# EAGLE design PJ23 (EAGLE 7.4.0)

## Sheet 1 of 8: ws2812 martix
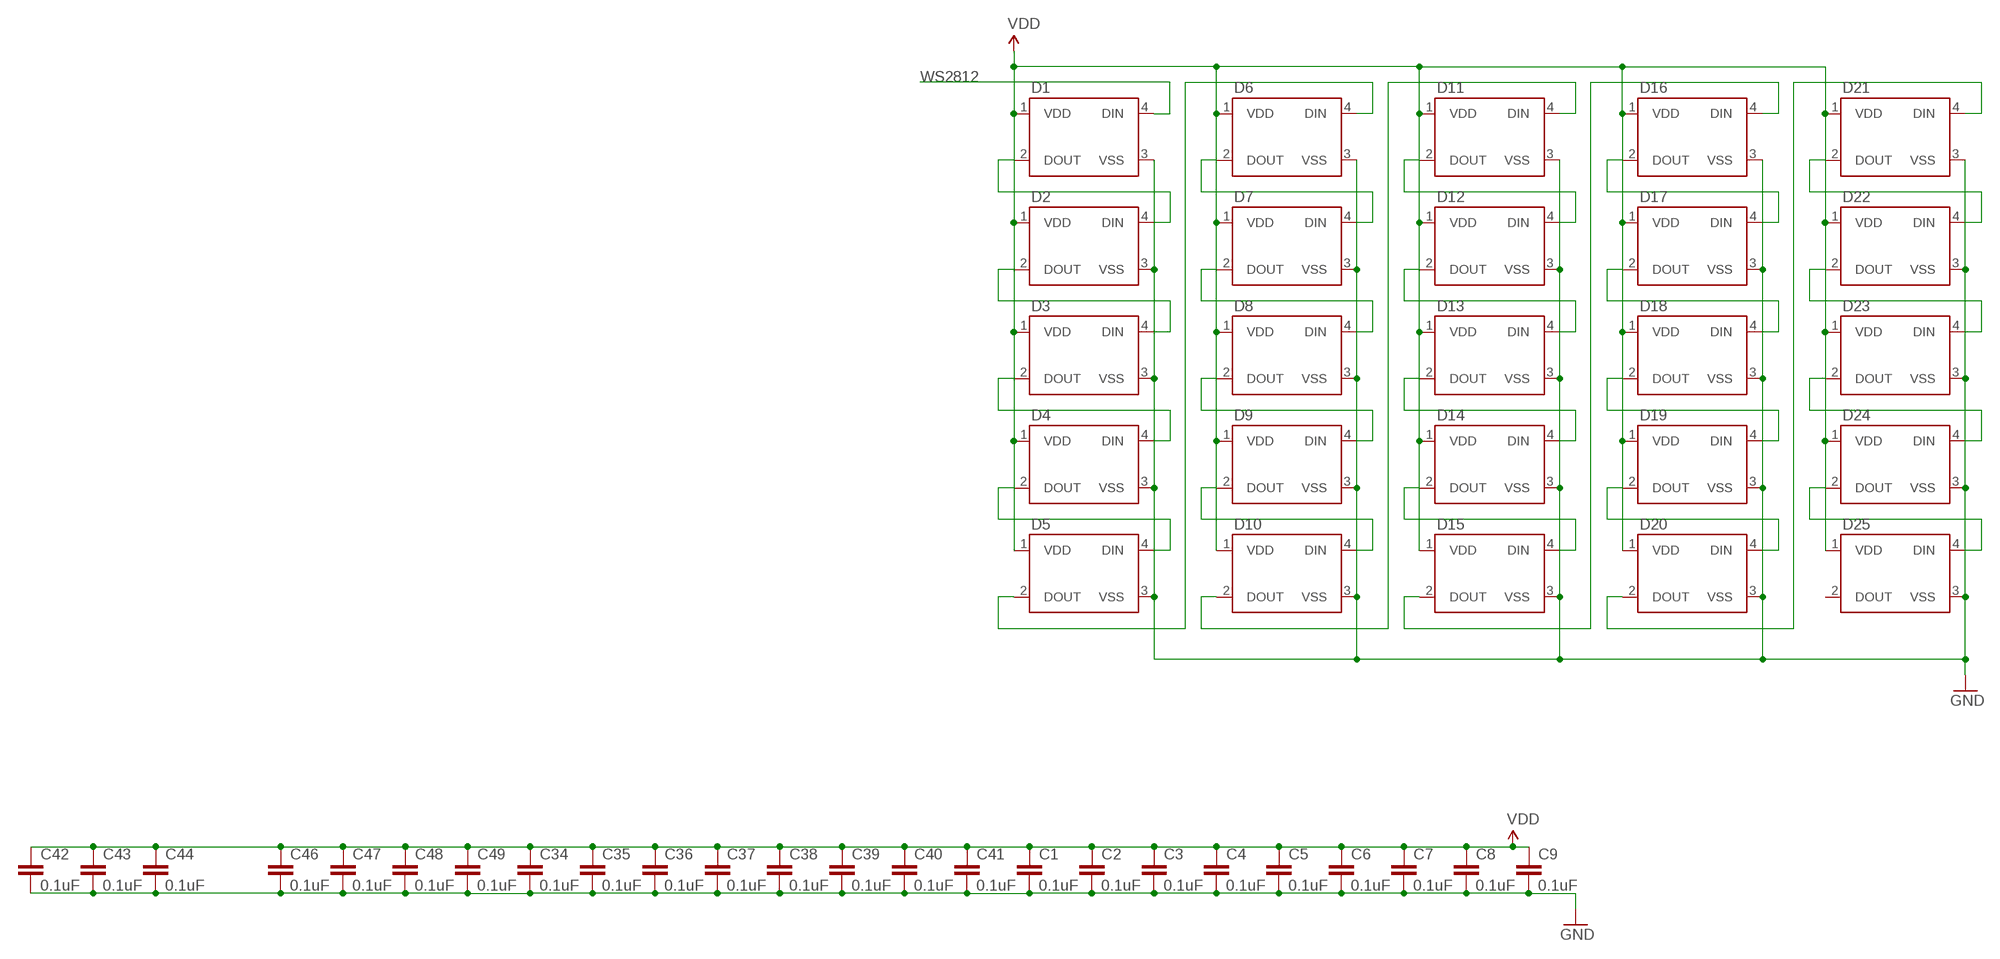
[diagram p0: schematic, sheet 1]

### Parts
C1  0.1uF  0.1UF-25V-5%(0603)  [0603-CAP]
C2  0.1uF  0.1UF-25V-5%(0603)  [0603-CAP]
C3  0.1uF  0.1UF-25V-5%(0603)  [0603-CAP]
C4  0.1uF  0.1UF-25V-5%(0603)  [0603-CAP]
C5  0.1uF  0.1UF-25V-5%(0603)  [0603-CAP]
C6  0.1uF  0.1UF-25V-5%(0603)  [0603-CAP]
C7  0.1uF  0.1UF-25V-5%(0603)  [0603-CAP]
C8  0.1uF  0.1UF-25V-5%(0603)  [0603-CAP]
C9  0.1uF  0.1UF-25V-5%(0603)  [0603-CAP]
C34  0.1uF  0.1UF-25V-5%(0603)  [0603-CAP]
C35  0.1uF  0.1UF-25V-5%(0603)  [0603-CAP]
C36  0.1uF  0.1UF-25V-5%(0603)  [0603-CAP]
C37  0.1uF  0.1UF-25V-5%(0603)  [0603-CAP]
C38  0.1uF  0.1UF-25V-5%(0603)  [0603-CAP]
C39  0.1uF  0.1UF-25V-5%(0603)  [0603-CAP]
C40  0.1uF  0.1UF-25V-5%(0603)  [0603-CAP]
C41  0.1uF  0.1UF-25V-5%(0603)  [0603-CAP]
C42  0.1uF  0.1UF-25V-5%(0603)  [0603-CAP]
C43  0.1uF  0.1UF-25V-5%(0603)  [0603-CAP]
C44  0.1uF  0.1UF-25V-5%(0603)  [0603-CAP]
C46  0.1uF  0.1UF-25V-5%(0603)  [0603-CAP]
C47  0.1uF  0.1UF-25V-5%(0603)  [0603-CAP]
C48  0.1uF  0.1UF-25V-5%(0603)  [0603-CAP]
C49  0.1uF  0.1UF-25V-5%(0603)  [0603-CAP]
D1  WS2812B  [WS2812B]
D2  WS2812B  [WS2812B]
D3  WS2812B  [WS2812B]
D4  WS2812B  [WS2812B]
D5  WS2812B  [WS2812B]
D6  WS2812B  [WS2812B]
D7  WS2812B  [WS2812B]
D8  WS2812B  [WS2812B]
D9  WS2812B  [WS2812B]
D10  WS2812B  [WS2812B]
D11  WS2812B  [WS2812B]
D12  WS2812B  [WS2812B]
D13  WS2812B  [WS2812B]
D14  WS2812B  [WS2812B]
D15  WS2812B  [WS2812B]
D16  WS2812B  [WS2812B]
D17  WS2812B  [WS2812B]
D18  WS2812B  [WS2812B]
D19  WS2812B  [WS2812B]
D20  WS2812B  [WS2812B]
D21  WS2812B  [WS2812B]
D22  WS2812B  [WS2812B]
D23  WS2812B  [WS2812B]
D24  WS2812B  [WS2812B]
D25  WS2812B  [WS2812B]

### Nets
GND: C1.2 C2.2 C3.2 C4.2 C5.2 C6.2 C7.2 C8.2 C9.2 C34.2 C35.2 C36.2 C37.2 C38.2 C39.2 C40.2 C41.2 C42.2 C43.2 C44.2 C46.2 C47.2 C48.2 C49.2 D1.3(VSS) D2.3(VSS) D3.3(VSS) D4.3(VSS) D5.3(VSS) D6.3(VSS) D7.3(VSS) D8.3(VSS) D9.3(VSS) D10.3(VSS) D11.3(VSS) D12.3(VSS) D13.3(VSS) D14.3(VSS) D15.3(VSS) D16.3(VSS) D17.3(VSS) D18.3(VSS) D19.3(VSS) D20.3(VSS) D21.3(VSS) D22.3(VSS) D23.3(VSS) D24.3(VSS) D25.3(VSS) ; also sheet 2,3,4,5,6,7,8
N$1: D1.2(DOUT) D2.4(DIN)
N$2: D2.2(DOUT) D3.4(DIN)
N$3: D3.2(DOUT) D4.4(DIN)
N$4: D4.2(DOUT) D5.4(DIN)
N$6: D5.2(DOUT) D6.4(DIN)
N$7: D6.2(DOUT) D7.4(DIN)
N$8: D7.2(DOUT) D8.4(DIN)
N$31: D8.2(DOUT) D9.4(DIN)
N$32: D9.2(DOUT) D10.4(DIN)
N$33: D10.2(DOUT) D11.4(DIN)
N$34: D11.2(DOUT) D12.4(DIN)
N$35: D12.2(DOUT) D13.4(DIN)
N$36: D13.2(DOUT) D14.4(DIN)
N$37: D14.2(DOUT) D15.4(DIN)
N$38: D15.2(DOUT) D16.4(DIN)
N$39: D16.2(DOUT) D17.4(DIN)
N$40: D17.2(DOUT) D18.4(DIN)
N$41: D18.2(DOUT) D19.4(DIN)
N$42: D19.2(DOUT) D20.4(DIN)
N$43: D20.2(DOUT) D21.4(DIN)
N$44: D21.2(DOUT) D22.4(DIN)
N$45: D22.2(DOUT) D23.4(DIN)
N$46: D23.2(DOUT) D24.4(DIN)
N$47: D24.2(DOUT) D25.4(DIN)
VDD: C1.1 C2.1 C3.1 C4.1 C5.1 C6.1 C7.1 C8.1 C9.1 C34.1 C35.1 C36.1 C37.1 C38.1 C39.1 C40.1 C41.1 C42.1 C43.1 C44.1 C46.1 C47.1 C48.1 C49.1 D1.1(VDD) D2.1(VDD) D3.1(VDD) D4.1(VDD) D5.1(VDD) D6.1(VDD) D7.1(VDD) D8.1(VDD) D9.1(VDD) D10.1(VDD) D11.1(VDD) D12.1(VDD) D13.1(VDD) D14.1(VDD) D15.1(VDD) D16.1(VDD) D17.1(VDD) D18.1(VDD) D19.1(VDD) D20.1(VDD) D21.1(VDD) D22.1(VDD) D23.1(VDD) D24.1(VDD) D25.1(VDD) ; also sheet 5,6
WS2812: D1.4(DIN) ; also sheet 4
Unconnected: D25.2(DOUT)

## Sheet 2 of 8: I2C bus devices
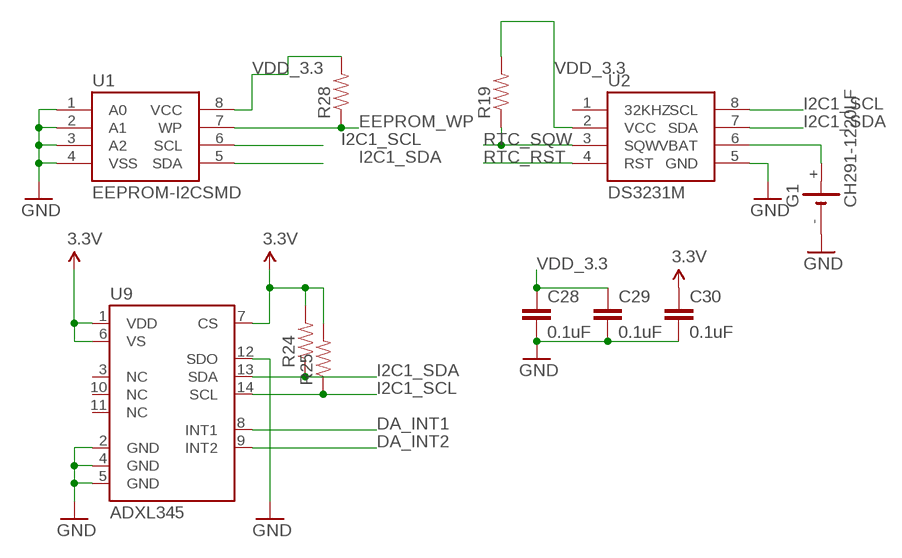
[diagram p1: schematic, sheet 2]

### Parts
C28  0.1uF  0.1UF-25V-5%(0603)  [0603-CAP]
C29  0.1uF  0.1UF-25V-5%(0603)  [0603-CAP]
C30  0.1uF  0.1UF-25V-5%(0603)  [0603-CAP]
G1  CH291-1220LF  [CH291-1220LF]
R19  RESISTOR0603  [0603-RES]
R24  RESISTOR0603  [0603-RES]
R25  RESISTOR0603  [0603-RES]
R28  RESISTOR0603  [0603-RES]
U1  EEPROM-I2CSMD  [SO08]
U2  DS3231M  [SOIC8]
U9  ADXL345  [LGA14]

### Nets
3.3V: C30.1 R24.2 R25.2 U9.1(VDD) U9.6(VS) U9.7(CS) ; also sheet 4,5,6
DA_INT1: U9.8(INT1) ; also sheet 4
DA_INT2: U9.9(INT2) ; also sheet 4
EEPROM_WP: R28.1 U1.7(WP) ; also sheet 4
GND: C28.2 C29.2 C30.2 G1.- U1.1(A0) U1.2(A1) U1.3(A2) U1.4(VSS) U2.5(GND) U9.2(GND) U9.4(GND) U9.5(GND) U9.12(SDO) ; also sheet 1,3,4,5,6,7,8
I2C1_SCL: R25.1 U1.6(SCL) U2.8(SCL) U9.14(SCL) ; also sheet 4
I2C1_SDA: R24.1 U1.5(SDA) U2.7(SDA) U9.13(SDA) ; also sheet 4
N$27: G1.+ U2.6(VBAT)
RTC_RST: U2.4(RST)
RTC_SQW: R19.1 U2.3(SQW)
VDD_3.3: C28.1 C29.1 R19.2 R28.2 U1.8(VCC) U2.2(VCC) ; also sheet 5
Unconnected: U2.1(32KHZ) U9.3(NC) U9.10(NC) U9.11(NC)

## Sheet 3 of 8: battery charger
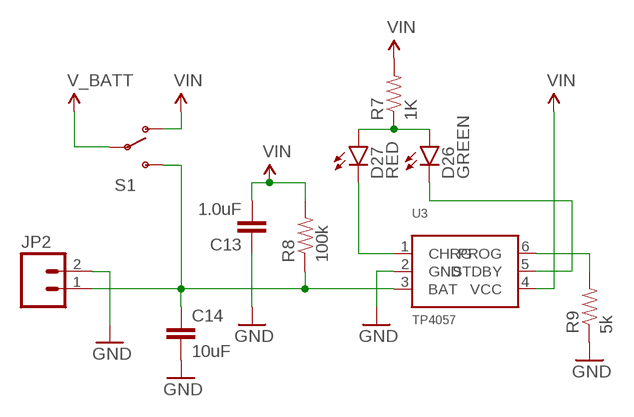
[diagram p2: schematic, sheet 3]

### Parts
C13  1.0uF  1.0UF-25V-+80/-20(0805)"  [0805-CAP]
C14  10uF  10UF-6.3V-20%(1206)  [1206]
D26  GREEN  LED-GREEN0603  [LED-0603]
D27  RED  LED-RED0603  [LED-0603]
JP2  M02LOCK  [1X02_LOCK]
R7  1K  1KOHM-1/10W-1%(0603)  [0603-RES]
R8  100k  100KOHM-1/10W-1%(0603)  [0603-RES]
R9  5k  RESISTOR0805-RES  [0805]
S1  SWITCH-SPDT-SMD-A  [SWITCH-SPST-SMD-A]
U3  TP4057  [SOT23-6]

### Nets
GND: C13.1 C14.2 JP2.2 R9.1 U3.2(GND) ; also sheet 1,2,4,5,6,7,8
N$12: D27.C U3.1(CHRG)
N$13: D26.C U3.5(STDBY)
N$16: D26.A D27.A R7.1
N$18: C14.1 JP2.1 R8.1 S1.3(S) U3.3(BAT)
N$19: R9.2 U3.6(PROG)
V_BATT: S1.2(P) ; also sheet 4,5,6
VIN: C13.2 R7.2 R8.2 S1.1(O) U3.4(VCC) ; also sheet 7,8

## Sheet 4 of 8: microcontroller
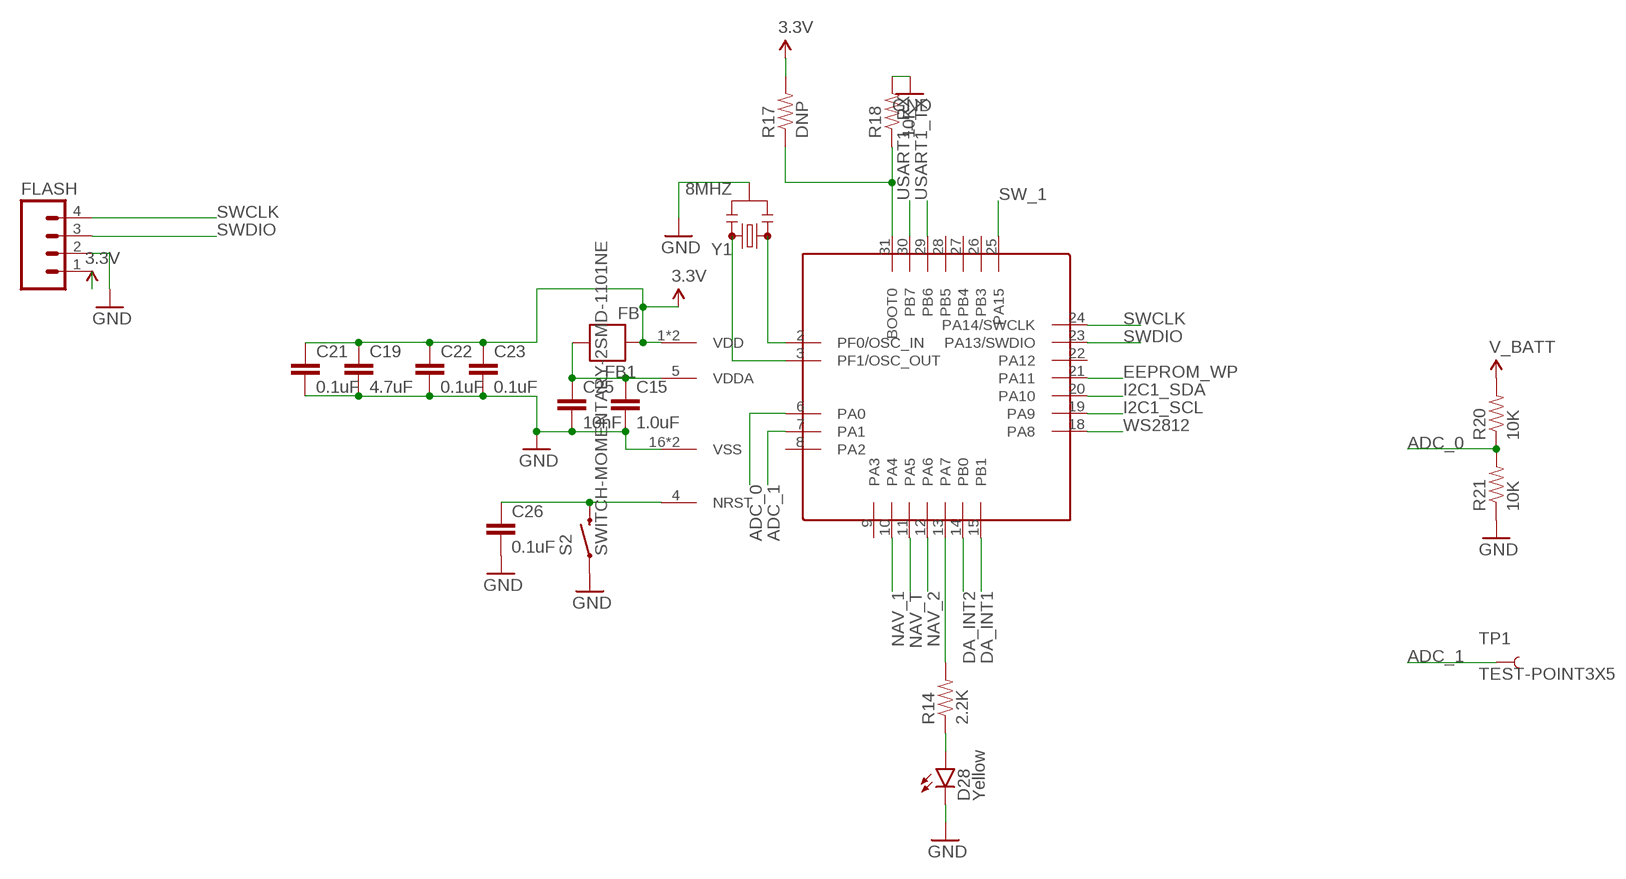
[diagram p3: schematic, sheet 4]

### Parts
C15  1.0uF  1.0UF-16V-10%(0603)  [0603-CAP]
C19  4.7uF  4.7UF-6.3V-10%(0603)0603  [0603-CAP]
C21  0.1uF  CAP0402-CAP  [0402-CAP]
C22  0.1uF  CAP0402-CAP  [0402-CAP]
C23  0.1uF  CAP0402-CAP  [0402-CAP]
C25  10nF  CAP0402-CAP  [0402-CAP]
C26  0.1uF  CAP0402-CAP  [0402-CAP]
D28  Yellow  LED-YELLOW0603  [LED-0603]
FB1  FB  [0603]
FLASH  M04SMD  [1X04-SMD]
R14  2.2K  RESISTOR0402  [0402-RES]
R17  DNP  22OHM1/10W1%(0402)  [0402-RES]
R18  10K  22OHM1/10W1%(0402)  [0402-RES]
R20  10K  22OHM1/10W1%(0402)  [0402-RES]
R21  10K  22OHM1/10W1%(0402)  [0402-RES]
S2  SWITCH-MOMENTARY-2SMD-1101NE  [TACTILE-SWITCH-1101NE]
TP1  TEST-POINT3X5  [PAD.03X.05]
U7  STM32F030K6P6  [LQFP32-0.8]
Y1  8MHZ  RESONATOR8MHZ  [RESONATOR-SMD]

### Nets
3.3V: C19.1 C21.1 C22.1 C23.1 FB1.2 FLASH.1 R17.2 U7.1(VDD) U7.17(VDD) ; also sheet 2,5,6
ADC_0: R20.1 R21.2 U7.6(PA0)
ADC_1: TP1.P$1 U7.7(PA1)
DA_INT1: U7.15(PB1) ; also sheet 2
DA_INT2: U7.14(PB0) ; also sheet 2
EEPROM_WP: U7.21(PA11) ; also sheet 2
GND: C15.2 C19.2 C21.2 C22.2 C23.2 C25.2 C26.2 D28.C FLASH.2 R18.2 R21.1 S2.1 U7.16(VSS) U7.32(VSS) Y1.2 ; also sheet 1,2,3,5,6,7,8
I2C1_SCL: U7.19(PA9) ; also sheet 2
I2C1_SDA: U7.20(PA10) ; also sheet 2
N$5: C15.1 C25.1 FB1.1 U7.5(VDDA)
N$23: R17.1 R18.1 U7.31(BOOT0)
N$24: D28.A R14.1
N$29: C26.1 S2.2 U7.4(NRST)
N$48: R14.2 U7.13(PA7)
NAV_1: U7.10(PA4) ; also sheet 6
NAV_2: U7.12(PA6) ; also sheet 6
NAV_T: U7.11(PA5) ; also sheet 6
PF0: U7.2(PF0/OSC_IN) Y1.1
PF1: U7.3(PF1/OSC_OUT) Y1.3
SW_1: U7.25(PA15) ; also sheet 6
SWCLK: FLASH.4 U7.24(PA14/SWCLK)
SWDIO: FLASH.3 U7.23(PA13/SWDIO)
USART1_RX: U7.30(PB7) ; also sheet 7
USART1_TX: U7.29(PB6) ; also sheet 7
V_BATT: R20.2 ; also sheet 3,5,6
WS2812: U7.18(PA8) ; also sheet 1
Unconnected: U7.8(PA2) U7.9(PA3) U7.22(PA12) U7.26(PB3) U7.27(PB4) U7.28(PB5)

## Sheet 5 of 8: power
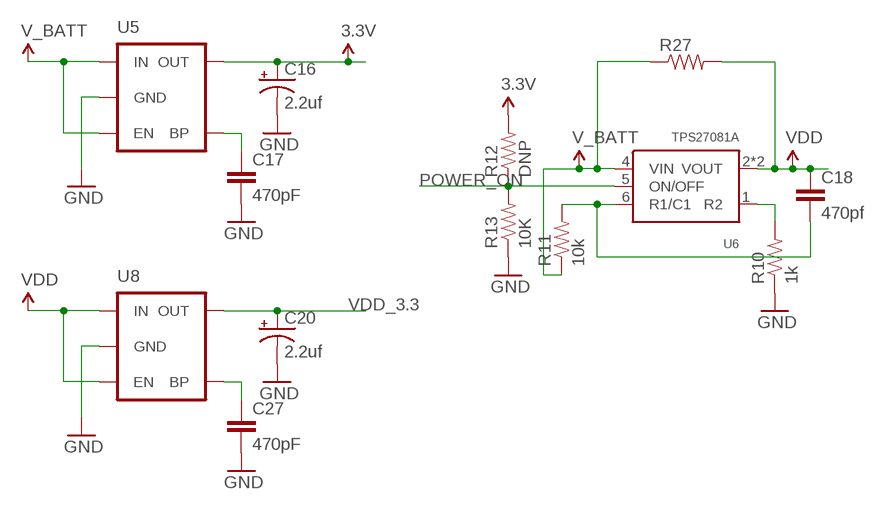
[diagram p4: schematic, sheet 5]

### Parts
C16  2.2uf  10UF-16V-10%(TANT)  [EIA3216]
C17  470pF  CAP0805  [0805]
C18  470pf  CAP1206  [1206]
C20  2.2uf  10UF-16V-10%(TANT)  [EIA3216]
C27  470pF  CAP0805  [0805]
R10  1k  RESISTOR0805-RES  [0805]
R11  10k  RESISTOR0805-RES  [0805]
R12  DNP  10KOHM-1/10W-1%(0603)0603  [0603-RES]
R13  10K  10KOHM-1/10W-1%(0603)0603  [0603-RES]
R27  RESISTOR0805-RES  [0805]
U5  MIC52053.3V  [SOT23-5]
U6  TPS27081A  [DDC(R-PDSO-G6)]
U8  MIC52053.3V  [SOT23-5]

### Nets
3.3V: C16.A(+) R12.2 U5.5(OUT) ; also sheet 2,4,6
GND: C16.C(-) C17.2 C20.C(-) C27.2 R10.1 R13.1 U5.2(GND) U8.2(GND) ; also sheet 1,2,3,4,6,7,8
N$20: R10.2 U6.1(R2)
N$21: C18.2 R11.2 U6.6(R1/C1)
N$22: C17.1 U5.4(BP)
N$28: C27.1 U8.4(BP)
POWER_ON: R12.1 R13.2 U6.5(ON/OFF)
V_BATT: R11.1 R27.1 U5.1(IN) U5.3(EN) U6.4(VIN) ; also sheet 3,4,6
VDD: C18.1 R27.2 U6.2(VOUT) U6.3(VOUT) U8.1(IN) U8.3(EN) ; also sheet 1,6
VDD_3.3: C20.A(+) U8.5(OUT) ; also sheet 2

## Sheet 6 of 8: switch
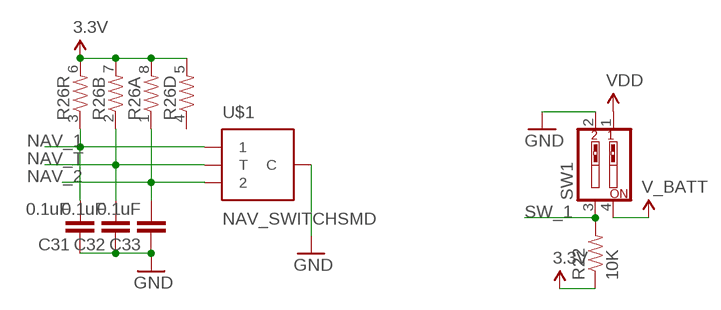
[diagram p5: schematic, sheet 6]

### Parts
C31  0.1uF  0.1UF-25V-5%(0603)  [0603-CAP]
C32  0.1uF  0.1UF-25V-5%(0603)  [0603-CAP]
C33  0.1uF  0.1UF-25V-5%(0603)  [0603-CAP]
R22  10K  RESISTOR0603  [0603-RES]
R26  RESISTOR-ARRAY0603-ARV  [0603-ARV]
SW1  SW_DIP-2-SMT-HALFSIZE  [DIPSWITCH-02-50MIL]
U$1  NAV_SWITCHSMD  [NAV_SWITCH]

### Nets
3.3V: R22.1 R26.5 R26.6 R26.7 R26.8 ; also sheet 2,4,5
GND: C31.1 C32.1 C33.1 SW1.2 U$1.C ; also sheet 1,2,3,4,5,7,8
NAV_1: C31.2 R26.3 U$1.1 ; also sheet 4
NAV_2: C33.2 R26.1 U$1.2 ; also sheet 4
NAV_T: C32.2 R26.2 U$1.T ; also sheet 4
SW_1: R22.2 SW1.3 ; also sheet 4
V_BATT: SW1.4 ; also sheet 3,4,5
VDD: SW1.1 ; also sheet 1,5
Unconnected: R26.4

## Sheet 7 of 8: usart
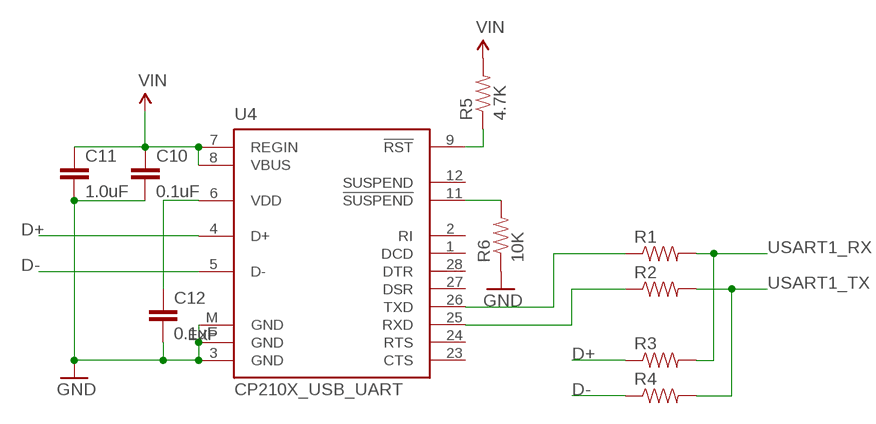
[diagram p6: schematic, sheet 7]

### Parts
C10  0.1uF  0.1UF-25V-5%(0603)  [0603-CAP]
C11  1.0uF  1.0UF-25V-+80/-20(0805)"  [0805-CAP]
C12  0.1uF  0.1UF-25V-5%(0603)  [0603-CAP]
R1  RESISTOR0603  [0603-RES]
R2  RESISTOR0603  [0603-RES]
R3  RESISTOR0603  [0603-RES]
R4  RESISTOR0603  [0603-RES]
R5  4.7K  4.7KOHM-1/10W-1%(0603)  [0603-RES]
R6  10K  10KOHM-1/10W-1%(0603)0603  [0603-RES]
U4  CP210X_USB_UART  [MLP28]

### Nets
D+: R3.1 U4.4(D+) ; also sheet 8
D-: R4.1 U4.5(D-) ; also sheet 8
GND: C10.2 C11.2 C12.2 R6.1 U4.3(GND) U4.EXP(GND) U4.M(GND) ; also sheet 1,2,3,4,5,6,8
N$9: C12.1 U4.6(VDD)
N$10: R5.1 U4.9(!RST)
N$11: R6.2 U4.11(!SUSPEND)
N$14: R1.1 U4.26(TXD)
N$15: R2.1 U4.25(RXD)
USART1_RX: R1.2 R3.2 ; also sheet 4
USART1_TX: R2.2 R4.2 ; also sheet 4
VIN: C10.1 C11.1 R5.2 U4.7(REGIN) U4.8(VBUS) ; also sheet 3,8
Unconnected: U4.1(DCD) U4.2(RI) U4.12(SUSPEND) U4.23(CTS) U4.24(RTS) U4.27(DSR) U4.28(DTR)

## Sheet 8 of 8: Connector
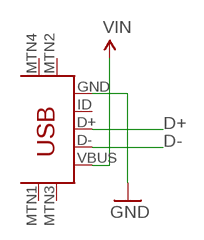
[diagram p7: schematic, sheet 8]

### Parts
JP1  USB-MINIB-5PIN  [USB-MINIB]

### Nets
D+: JP1.D+ ; also sheet 7
D-: JP1.D- ; also sheet 7
GND: JP1.GND ; also sheet 1,2,3,4,5,6,7
VIN: JP1.VBUS ; also sheet 3,7
Unconnected: JP1.ID JP1.MTN1(MTN2) JP1.MTN2(MTN3) JP1.MTN3(MTN1) JP1.MTN4

## Library data of the parts
C1-C10 C12 C28-C44 C46-C49 = SparkFun-Capacitors:0.1UF-25V-5%(0603): CAP-08604; PROD_ID: CAP-08604
C11 C13 = SparkFun-Capacitors:1.0UF-25V-+80/-20(0805): CAP-11625; PROD_ID: CAP-11625
C14 = SparkFun-Capacitors:10UF-6.3V-20%(1206): CAP-10057 Ceramic; PROD_ID: CAP-10057
C15 = SparkFun-Capacitors:1.0UF-16V-10%(0603): CAP-00868; PROD_ID: CAP-00868
C16 C20 = SparkFun-Capacitors:10UF-16V-10%(TANT): CAP-00811 1206/EIA-3216 Tantalum capacitor; PROD_ID: CAP-00811; VALUE: 10uF
C17 C27 = SparkFun-Passives:CAP: Capacitor Standard 0603 ceramic capacitor, and 0.1" leaded capacitor.
C18 C21-C23 C25 C26 = SparkFun-Capacitors:CAP: Capacitor Standard 0603 ceramic capacitor, and 0.1" leaded capacitor.
C19 = SparkFun-Capacitors:4.7UF-6.3V-10%(0603): CAP-08280; PROD_ID: CAP-08280
D1-D25 = SparkFun-LED:WS2812B: WS2812B - Intelligent control LED integrated light source Technical Specifications: Power Supply Voltage (VDD): 3.5 to 5.3 V Input Voltage (VI): -0.5 to VDD+0.5 V Operating Junction Temperature (Topt): -25°C to +80°C Storage Temperature Range (Tstg): -55°C to +150°C; PROD_ID: DIO-12503
D26 = SparkFun-LED:LED-GREEN: Various green LEDs Green LEDs used in SFE Production 0603- DIO-00821 LARGE- DIO-00862 LILYPAD- DIO-09910; PROD_ID: DIO-00821
D27 = SparkFun-LED:LED-RED: Assorted Red LEDs LilyPad 1206- DIO-09912 1206- DIO-00809 0603- DIO-00819 "SMART" means more efficient and expensive; PROD_ID: DIO-00819
D28 = SparkFun-LED:LED-YELLOW: Yellow SMD LEDs LilyPad 1206- DIO-09909 0603- DIO-09003 "SMART" means more efficient and expensive; PROD_ID: DIO-09003
FB1 = SparkFun-Passives:FB
FLASH = SparkFun-Connectors:M04: Header 4 Standard 4-pin 0.1" header. Use with straight break away headers (SKU : PRT-00116), right angle break away headers (PRT-00553), swiss pins (PRT-00743), machine pins (PRT-00117), and female headers (PRT-00115). Molex polarized connector foot print use with SKU : PRT-08231 with associated crimp pins and housings. 1MM SMD Version SKU: PRT-10208
G1 = battery:CH291-1220LF: Battery Holder, SMT, 12mm multicomp PART NO. CH291-1220LF Source: Data sheet <http://www.farnell.com/datasheets/1505860.pdf>
JP1 = SparkFun-Connectors:USB-MINIB: Mini-USB "B" connector with 5th pin broken out. Created new symbol breaking out 5th "ID" pin in mini/micro USB connector spec. See: http://en.wikipedia.org/wiki/Mini_usb#Cables. Uses same footprint as 4-pin symbol. Also added pins to connect to mounting / shield pads if required (probably not generally needed as signals aren't shielded once they leave the connector).; PROD_ID: CONN-08193
JP2 = SparkFun-Connectors:M02: Standard 2-pin 0.1" header. Use with - straight break away headers ( PRT-00116) - right angle break away headers (PRT-00553) - swiss pins (PRT-00743) - machine pins (PRT-00117) - female headers (PRT-00115) Molex polarized connector foot print use with: PRT-08233 with associated crimp pins and housings. 2.54_SCREWTERM for use with PRT-10571. 3.5mm Screw Terminal footprints for PRT-08084 5mm Screw Terminal footprints for use with PRT-08432
R1-R4 R9-R11 R14 R19 R22 R24 R25 R27 R28 = SparkFun-Resistors:RESISTOR: Resistor Basic schematic elements and footprints for 0603, 1206, and PTH resistors.
R5 = SparkFun-Resistors:4.7KOHM-1/10W-1%(0603): RES-07857; PROD_ID: RES-07857
R6 R13 = SparkFun-Resistors:10KOHM-1/10W-1%(0603): RES-00824; PROD_ID: RES-00824
R7 = SparkFun-Resistors:1KOHM-1/10W-1%(0603): RES-07856; PROD_ID: RES-07856
R8 = SparkFun-Resistors:100KOHM-1/10W-1%(0603): RES-07828; PROD_ID: RES-07828
R12 = SparkFun-Resistors:10KOHM-1/10W-1%(0603): RES-00824; PROD_ID: RES-00824; VALUE: 10K
R17 R18 R20 R21 = SparkFun-Resistors:22OHM1/10W1%(0402); PROD_ID: RES-12427; VALUE: 22
R26 = SparkFun-Resistors:RESISTOR-ARRAY: Array Chip Resistor Source: RS Component / Phycomp
S1 = SparkFun-Electromechanical:SWITCH-SPDT: SPDT Switch Simple slide switch, Spark Fun Electronics SKU : COM-00102 DPDT SMT slide switch, AYZ0202, SWCH-08179
S2 = SparkFun-Electromechanical:SWITCH-MOMENTARY-2: Various NO switches- pushbuttons, reed, etc; PROD_ID: SWCH-00815
SW1 = SparkFun-Electromechanical:SW_DIP-2: DIP SWITCH
TP1 = SparkFun-Passives:TEST-POINT: Bare copper test points for troubleshooting or ICT
U1 = SparkFun-DigitalIC:EEPROM-I2C: I2C EEPROM chips, 24LC256 (and others)
U2 = SparkFun-DigitalIC:DS3231M: DS3231M Real Time Clock. Accuracy +/-5ppm. Battery Backup. 2.3V to 5.5V.; PROD_ID: IC-11985
U3 = SparkFun-AnalogIC:TP4057
U4 = SparkFun-DigitalIC:CP210X_USB_UART: Single-Chip USB to UART Bridge Source: www.silabs.com .. CP2101.pdf / cp2102.pdf. Spark Fun Electronics SKU : COM-00310
U5 U8 = SparkFun-PowerIC:MIC5205: MIC5205 150mA vreg 3.3V - VREG-00822 5V - VREG-00823; PROD_ID: VREG-00822
U6 = PJ23:TPS27081A
U7 = r1:STM32F030K6P6
U9 = SparkFun-Sensors:ADXL345: 3-axis SPI/I2C 2/4/8/16g accelerometer
U$1 = SparkFun-Electromechanical:NAV_SWITCH: Navigation Switch Three way navigation switch. Commonly used as up/down/select on MP3 players. Schematic element and footprint production proven. Spark Fun Electronics SKU : COM-08184; PROD_ID: SWCH-08301
Y1 = SparkFun-FreqCtrl:RESONATOR: Resonator Small SMD resonator. Used, eg, on the Arduino Pro/ Pro Mini boards. 8MHz- XTAL-08895 16MHz- XTAL-08900; PROD_ID: XTAL-08895

## Board
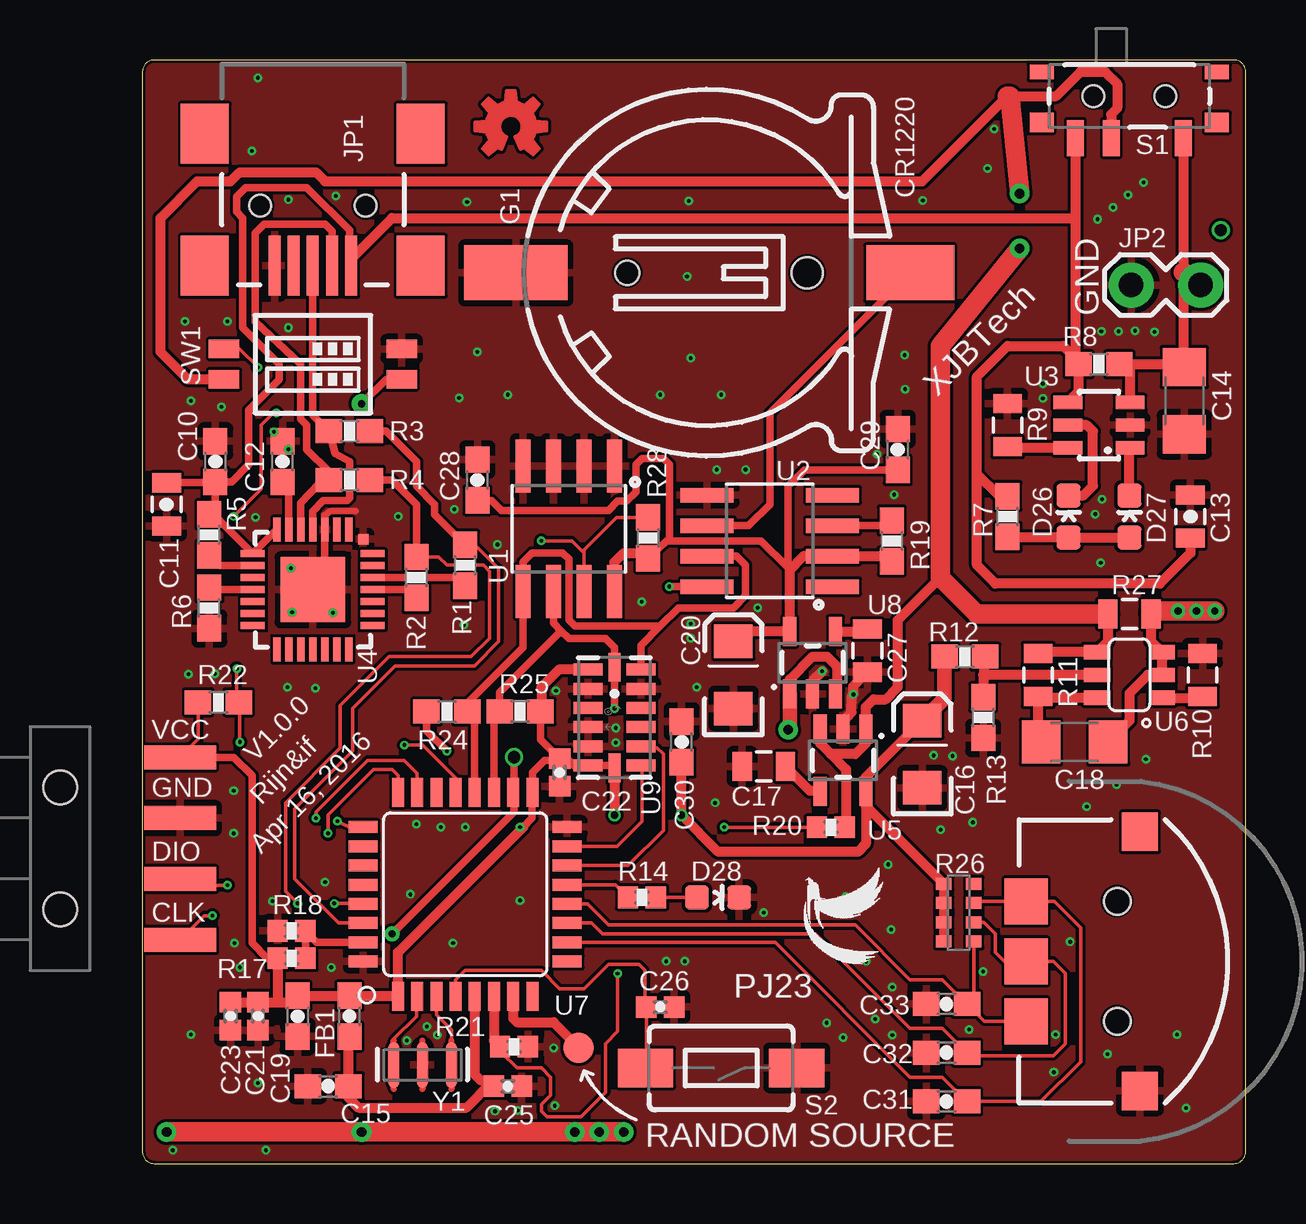
[diagram p8: board, top side]
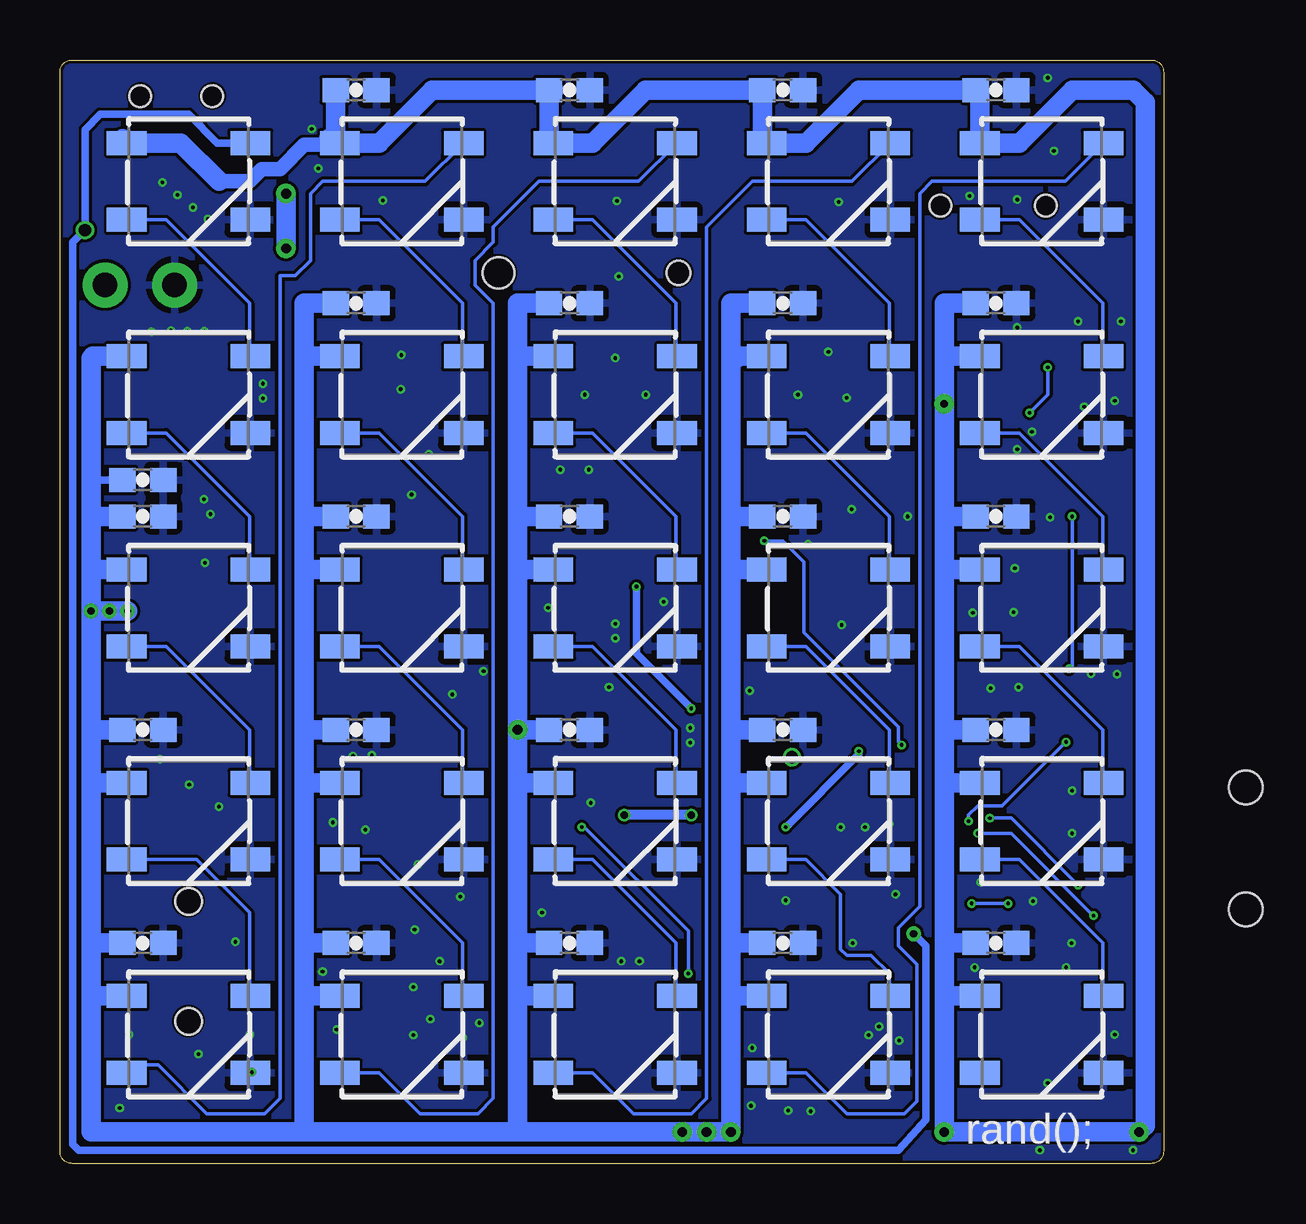
[diagram p9: board, bottom side, seen from below]

Size 46 x 46 mm. Coordinates in mm from the lower left corner, seen from the top.
Outline: 45.49,46 0.51,46 arc90 0,45.49 0,0.51 arc90 0.51,0 45.49,0 arc90 46,0.51 46,45.49 arc90 45.49,46
Copper layers (1*16): Top 0.035mm / dielectric 1.5mm / Bottom 0.035mm
Design rules "DRU1_SAMPLE_SYJ_2LAYERS_FR4": minimum track width 5mil, minimum drill 6mil, track to track 5mil, track to pad 5mil, pad to pad 5mil, via to via 5mil, smd to smd 5mil, copper to edge 5mil, drill to drill 5mil, minimum pad ring 4mil, minimum via ring 4mil, stop-mask expansion 4mil, vias tented up to drill 18mil, thermal gap 10mil

### Footprints (pad centres in the part's own frame; a part is rotated, then mirrored left to right if it is on the bottom)
0603-CAP = smd 1.1 x 1: 1 -0.85,0; 2 0.85,0
0805-CAP = smd 0.8 x 1.2: 1 -0.9,0; 2 0.9,0
1206 = smd 1.6 x 1.8: 1 -1.4,0; 2 1.4,0
EIA3216 = smd 1.4 x 1.6: A 1.4,0; C -1.4,0
0805 = smd 0.8 x 1.2: 1 -0.9,0; 2 0.9,0
0402-CAP = smd 0.85 x 0.9: 1 -0.58,0; 2 0.58,0
WS2812B = smd 1.651 x 1: 1 -2.577,1.6; 2 -2.577,-1.6; 3 2.577,-1.6; 4 2.577,1.6
LED-0603 = smd 1 x 1: A 0,-0.877; C 0,0.877
0603 = smd 1.1 x 1: 1 -0.85,0; 2 0.85,0
1X04-SMD = smd 1 x 3: 1 -3.81,5; 2 -1.27,5; 3 1.27,5; 4 3.81,5 | hole 1.4: -2.54,0; 2.54,0
CH291-1220LF = smd 2.3 x 3.66: + 0,-2.296 | smd 2.3 x 4.3: - 0,14.146 | hole 1.3: 0,2 | hole 1: 0,9.5
USB-MINIB = smd 2.5 x 0.5: D+ 2.5,0; D- 2.5,0.8; GND 2.5,-1.6; ID 2.5,-0.8; VBUS 2.5,1.6 | smd 2.5 x 2: MTN1 -3,4.5; MTN2 2.5,4.5; MTN3 -3,-4.5; MTN4 2.5,-4.5 | hole 0.9: 0,2.2; 0,-2.2
1X02_LOCK = drill 1.016 pad 1.88: 1 -0.178,0; 2 2.718,0
0603-RES = smd 1.1 x 1: 1 -0.85,0; 2 0.85,0
0402-RES = smd 0.85 x 0.9: 1 -0.58,0; 2 0.58,0
0603-ARV = smd 0.5 x 0.65: 1 -1.2,-0.625; 2 -0.4,-0.625; 3 0.4,-0.625; 4 1.2,-0.625; 5 1.2,0.625; 6 0.4,0.625; 7 -0.4,0.625; 8 -1.2,0.625
SWITCH-SPST-SMD-A = smd 0.7 x 1.5: 1 -2.25,-1.75; 2 -0.75,-1.75; 3 2.25,-1.75 | smd 1 x 0.6: GND1 -3.65,1; GND3 3.65,1 | smd 1 x 0.8: GND2 -3.65,-1.1; GND4 3.65,-1.1 | hole 0.9: -1.5,0; 1.5,0
TACTILE-SWITCH-1101NE = smd 2.3 x 1.6: 1 -3.15,0; 2 3.15,0
DIPSWITCH-02-50MIL = smd 0.762 x 1.27: 1 -0.635,-3.7; 2 0.635,-3.7; 3 0.635,3.7; 4 -0.635,3.7
PAD.03X.05 = smd 1.27 x 1.27: P$1 0,0
SO08 = smd 0.61 x 2.21: 1 -1.905,-2.616; 2 -0.635,-2.616; 3 0.635,-2.616; 4 1.905,-2.616; 5 1.905,2.616; 6 0.635,2.616; 7 -0.635,2.616; 8 -1.905,2.616
SOIC8 = smd 0.61 x 2.21: 1 -1.905,-2.616; 2 -0.635,-2.616; 3 0.635,-2.616; 4 1.905,-2.616; 5 1.905,2.616; 6 0.635,2.616; 7 -0.635,2.616; 8 -1.905,2.616
SOT23-6 = smd 0.55 x 1.2: 1 0.95,1.3; 2 0,1.3; 3 -0.95,1.3; 4 -0.95,-1.3; 5 0,-1.3; 6 0.95,-1.3
MLP28 = smd 1 x 0.3: 1 -2.5,1.5; 2 -2.5,1; 3 -2.5,0.5; 4 -2.5,0; 5 -2.5,-0.5; 6 -2.5,-1; 7 -2.5,-1.5; 15 2.5,-1.5; 16 2.5,-1; 17 2.5,-0.5; 18 2.5,0; 19 2.5,0.5; 20 2.5,1; 21 2.5,1.5 | smd 0.3 x 1: 8 -1.5,-2.5; 9 -1,-2.5; 10 -0.5,-2.5; 11 0,-2.5; 12 0.5,-2.5; 13 1,-2.5; 14 1.5,-2.5; 22 1.5,2.5; 23 1,2.5; 24 0.5,2.5; 25 0,2.5; 26 -0.5,2.5; 27 -1,2.5; 28 -1.5,2.5 | smd 2.7 x 2.7: EXP 0,0 | smd 0.435 x 0.435: M -2.103,2.103
SOT23-5 = smd 0.55 x 1.2: 1 -0.95,-1.3; 2 0,-1.3; 3 0.95,-1.3; 4 0.95,1.3; 5 -0.95,1.3
DDC(R-PDSO-G6) = smd 0.6 x 1.1: 1 -0.95,-1.35; 2 0,-1.35; 3 0.95,-1.35; 4 0.95,1.35; 5 0,1.35; 6 -0.95,1.35
LQFP32-0.8 = smd 0.5 x 1.2: 1 -2.8,-4.25; 2 -2,-4.25; 3 -1.2,-4.25; 4 -0.4,-4.25; 5 0.4,-4.25; 6 1.2,-4.25; 7 2,-4.25; 8 2.8,-4.25; 17 2.8,4.25; 18 2,4.25; 19 1.2,4.25; 20 0.4,4.25; 21 -0.4,4.25; 22 -1.2,4.25; 23 -2,4.25; 24 -2.8,4.25 | smd 1.2 x 0.5: 9 4.25,-2.8; 10 4.25,-2; 11 4.25,-1.2; 12 4.25,-0.4; 13 4.25,0.4; 14 4.25,1.2; 15 4.25,2; 16 4.25,2.8; 25 -4.25,2.8; 26 -4.25,2; 27 -4.25,1.2; 28 -4.25,0.4; 29 -4.25,-0.4; 30 -4.25,-1.2; 31 -4.25,-2; 32 -4.25,-2.8
LGA14 = smd 0.5 x 1.2: 1 2,1.1; 2 1.2,1.1; 3 0.4,1.1; 4 -0.4,1.1; 5 -1.2,1.1; 6 -2,1.1; 8 -2,-1.1; 9 -1.2,-1.1; 10 -0.4,-1.1; 11 0.4,-1.1; 12 1.2,-1.1; 13 2,-1.1 | smd 1.2 x 0.5: 7 -2.1,0; 14 2.1,0
NAV_SWITCH = smd 1.9 x 1.8: 1 -2.5,-3.8; 2 2.5,-3.8; T 0,-3.8 | smd 1.6 x 1.5: C 5.4,0.95; NC -5.4,0.95 | hole 1.1: -2.5,0; 2.5,0
RESONATOR-SMD = smd 0.45 x 1.905: 1 -1.2,0; 2 0,0; 3 1.2,0

### Placement (x,y rotation side)
C1  6.99,26.97 0 bottom
C2  6.99,18.08 0 bottom
C3  6.99,44.75 0 bottom
C4  15.88,44.75 0 bottom
C5  24.77,44.75 0 bottom
C6  15.88,18.08 0 bottom
C7  6.99,9.19 0 bottom
C8  24.77,35.86 0 bottom
C9  15.88,35.86 0 bottom
C10  3.05,29.26 90 top
C11  1.02,27.48 270 top
C12  5.84,29.26 90 top
C13  43.69,26.97 270 top
C14  43.43,31.8 270 top
C15  7.75,3.22 180 top
C16  32.51,17.06 90 top
C17  25.91,16.56 180 top
C18  38.86,17.57 180 top
C19  6.48,6.14 270 top
C20  24.64,20.37 90 top
C21  4.83,6.14 270 top
C22  17.4,16.3 270 top
C23  3.68,6.14 270 top
C25  15.24,3.22 0 top
C26  21.59,6.52 0 top
C27  30.23,21.38 270 top
C28  13.97,28.49 90 top
C29  31.5,29.76 90 top
C30  22.48,17.57 90 top
C31  33.53,2.59 0 top
C32  33.53,4.62 0 top
C33  33.53,6.65 0 top
C34  6.99,35.86 0 bottom
C35  15.88,9.19 0 bottom
C36  24.77,9.19 0 bottom
C37  24.77,18.08 0 bottom
C38  24.77,26.97 0 bottom
C39  15.88,26.97 0 bottom
C40  33.66,44.75 0 bottom
C41  33.66,35.86 0 bottom
C42  33.66,26.97 0 bottom
C43  33.66,18.08 0 bottom
C44  42.55,28.49 0 bottom
C46  42.55,18.08 0 bottom
C47  42.55,26.97 0 bottom
C48  33.66,9.19 0 bottom
C49  42.55,9.19 0 bottom
D1  40.64,40.94 0 bottom
D2  40.64,32.05 0 bottom
D3  40.64,23.16 0 bottom
D4  40.64,14.27 0 bottom
D5  40.64,5.38 0 bottom
D6  31.75,40.94 0 bottom
D7  31.75,32.05 0 bottom
D8  31.75,23.16 0 bottom
D9  31.75,14.27 0 bottom
D10  31.75,5.38 0 bottom
D11  22.86,40.94 0 bottom
D12  22.86,32.05 0 bottom
D13  22.86,23.16 0 bottom
D14  22.86,14.27 0 bottom
D15  22.86,5.38 0 bottom
D16  13.97,40.94 0 bottom
D17  13.97,32.05 0 bottom
D18  13.97,23.16 0 bottom
D19  13.97,14.27 0 bottom
D20  13.97,5.38 0 bottom
D21  5.08,40.94 0 bottom
D22  5.08,32.05 0 bottom
D23  5.08,23.16 0 bottom
D24  5.08,14.27 0 bottom
D25  5.08,5.38 0 bottom
D26  38.61,26.97 0 top
D27  41.15,26.97 0 top
D28  24,11.1 270 top
FB1  8.64,6.14 90 top
FLASH  -3.43,13.13 270 top
G1  29.72,37.13 90 top
JP1  7.11,39.92 270 top
JP2  43.94,36.62 180 top
R1  13.46,24.94 90 top
R2  11.43,24.43 90 top
R3  8.64,30.53 0 top
R4  8.64,28.49 0 top
R5  2.79,26.21 90 top
R6  2.79,23.16 90 top
R7  36.07,26.97 90 top
R8  39.88,33.32 180 top
R9  36.07,30.78 270 top
R10  44.2,20.37 270 top
R11  37.34,20.37 270 top
R12  34.29,21.13 180 top
R13  35.05,18.59 90 top
R14  20.83,11.1 180 top
R17  6.22,8.56 180 top
R18  6.22,9.7 180 top
R19  31.24,25.95 270 top
R20  28.7,14.02 0 top
R21  15.49,4.87 180 top
R22  3.17,19.22 0 top
R24  12.7,18.84 180 top
R25  15.75,18.84 0 top
R26  34.04,10.46 90 top
R27  41.15,22.91 0 top
R28  21.08,26.08 270 top
S1  41.15,44.5 0 top
S2  24.13,3.98 180 top
SW1  7.11,33.32 90 top
TP1  18.19,4.82 0 top
U1  17.78,26.46 180 top
U2  26.16,25.95 90 top
U3  39.88,30.78 270 top
U4  7.11,23.92 270 top
U5  29.21,16.81 180 top
U6  41.15,20.37 90 top
U7  13.46,11.22 0 top
U8  27.94,20.87 0 top
U9  19.68,18.59 90 top
U$1  40.64,8.43 270 top
U$2  [LOGO]  27.56,8.3 0 top
U$3  [OSHW-LOGO-S_COPPER]  15.37,43.23 0 top
Y1  11.68,4.11 0 top

### Tracks (layer width: path | path; a pad name or v marks a point on that pad's centre or on a via)
3.3V  (via drill 0.15, 0.3)
  Top 0.152: R22.1 2.33,17.69 FLASH.1
  Top 0.305: R24.2 11.85,18.04 v12.7,17.19 | v15.75,14.02 15.88,14.02 16.26,14.4 U7.17 16.26,16.31 16.76,16.81 17.33,16.81 C22.1 | R25.2 16.6,17.68 C22.1 | C22.1 17.71,16.88 18.03,16.56 18.55,16.56 U9.6 19.59,16.59 U9.7 | FLASH.1 3.81,16.94 4.57,16.18 4.57,9.19 5.21,8.56 R17.2
  Top 0.406: U5.5 30.16,16.11 C16.A | C23.1 C21.1 5.71,6.72 | 5.71,6.72 6.21,6.72 C19.1 FB1.2 10.64,6.99 U7.1 10.66,8.8 15.88,14.02 | R17.2 5.64,6.79 5.71,6.72 | U5.5 30.16,14.91 R26.5 R26.6 R26.7 R26.8 | U9.7 v19.68,14.52 | C30.1 v22.48,14.52 24,13 29.84,13 30.16,13.32 U5.5 | U9.1 17.37,20.59 16.64,19.86 16.64,19.14 R25.2
  Top 0.61: R12.2 33.44,19.39 C16.A
  Bottom 0.305: v12.7,17.19 12.7,17.06 v15.75,14.02
  Bottom 0.406: v19.68,14.52 v22.48,14.52
ADC_0  (via drill 0.15)
  Top 0.152: R20.1 v24.26,14.02 | v19.81,7.92 19.81,5.51 19.3,5 19.3,2.97 18.29,1.95 16.87,1.95 16.64,2.18 16.64,2.46 17.02,2.84 17.02,3.6 16.64,3.98 15.62,3.98 14.99,4.62 14.99,4.8 R21.2
  Top 0.406: U7.6 14.66,5.12 R21.2
  Bottom 0.152: v24.26,14.02 24.13,14.02 19.81,9.7 v19.81,7.92
ADC_1
  Top 0.406: U7.7 15.46,6.05 15.62,5.89 17.14,5.89 18.16,4.87 TP1.P$1
D+
  Top 0.305: JP1.D+ 7.11,31.2 R3.1 8.04,29.6 8.64,29.26 8.64,27.73 8.53,27.63 7.54,27.63 7.11,27.17 U4.4
D-
  Top 0.305: U4.5 6.6,27.53 7.37,28.34 R4.1 7.79,28.84 6.86,29.76 6.86,30.78 6.6,31.03 6.6,33.32 4.7,35.1 4.7,38.78 5.08,39.16 7.62,39.16 7.91,38.87 JP1.D-
DA_INT1
  Top 0.152: U7.15 19.78,13.22 20.83,14.27 20.83,16.55 U9.8
DA_INT2
  Top 0.152: U7.14 20.25,12.42 21.72,13.89 21.72,17.06 21.46,17.32 20.86,17.32 U9.9
EEPROM_WP  (via drill 0.15)
  Top 0.152: R28.1 19.77,26.93 18.41,25.57 U1.7 18.41,25.45 17.91,25.95 v16.64,25.95 | v10.92,17.45 11.68,17.45 13.08,16.05 13.08,15.49 U7.21
  Bottom 0.152: v16.64,25.95 15.88,25.95 14.99,25.07 14.99,22.14 11.05,18.21 11.05,17.57 v10.92,17.45
GND  (via drill 0.15)
  Top 0.152: v5.49,30.5 5.49,30.46 C12.2
  Top 0.279: 7.61,27.01 7.82,27.2 8.89,27.2
  Top 0.305: v6.25,22.98 7.11,23.85 U4.EXP 7.61,24.42 U4.3 7.61,27.01
  Top 0.406: U8.2 27.94,20.11 v28.35,20.52 | C27.2 29.64,19.9 v29.64,19.55 29.59,19.5 29.57,18.82 29.21,18.44 U5.2
  other vias: 12.95,9.19 15.75,10.97 11.18,11.22 11.43,14.14 12.45,14.02 13.46,14.02 7.87,8.17 7.62,11.73 3.81,15.54 3.81,13.76 4.06,8.17 2.03,5.38 4.83,3.35 1.27,0.55 21.84,8.43 22.61,8.43 25.91,10.46 23.88,15.03 23.11,19.86 22.86,21.89 25.65,23.16 20.83,23.41 17.25,19.71 13.21,31.92 15.24,32.05 13.97,33.83 21.59,32.05 24.13,32.05 22.86,33.57 1.78,35.1 3.56,35.1 6.1,40.18 4.57,42.21 4.83,45.26 6.1,34.84 2.03,31.8 3.3,31.54 6.1,29.76 10.67,26.97 31.34,27.88 31.8,32.28 31.78,33.7 7.95,22.96 6.2,24.81 1.93,20.39 3.02,20.42 39.98,34.69 40.69,34.69 41.38,34.72 42.19,34.67 39.83,39.37 40.46,39.85 41.1,40.38 41.73,40.89 37.54,32.51 37.54,31.9 39.73,27.07 40.01,27.68 39.95,25.04 30.63,29.56 23.95,28.93 25.15,28.93 14.81,25.8 13,27.27 33.78,16.99 32.99,17.01 38,3.81 43.51,2.31 43.13,5.38 40.23,4.57 28.52,5.86 29.21,5.25 31.27,7.36 30.18,8.43 30.56,6.01 31.27,5.35 15.65,2.21 14.71,2.18 17.14,4.82 11.86,5.71 12.29,5.35 11.02,5.13 17.2,2.41 5.44,10.94 3.84,9.19 19.74,17.55 19.74,18.16 22.86,22.5 34.62,14.22 33.27,13.91 39.37,14.88 40.61,15.79 41.83,16.86 32.54,40.15 22.78,40.13 13.54,40.08 8.08,40.33 35.23,41.47 22.71,36.98 4.72,26.94 13.41,22.45 7.21,19.81 6.05,19.86 5.16,0.55 38.68,9.24 34.47,5.58 35.05,8 38.07,5.38 31.22,9.75 29.31,11.12 31.09,12.47 35.51,43.12
  pour Bottom (rank 6): 0,48.56 7.62,48.56 7.62,53.64 12.7,53.64 12.7,48.56 48.26,48.56 48.26,-2.24 0,-2.24
  pour Top (rank 6): 0,48.56 0,53.64 5.08,53.64 5.08,48.56 48.26,48.56 48.26,-2.24 0,-2.24
I2C1_SCL  (via drill 0.15)
  Top 0.305: U1.6 17.14,22.53 17.46,22.21 | 17.46,22.21 17.78,21.89 19.3,21.89 19.68,21.51 U9.14 v19.68,18.97 | U7.19 14.66,18.61 R25.1 14.9,19.64 17.46,22.21 | U2.8 v21.97,24.05
  Bottom 0.305: v21.97,24.05 21.97,21.25 v19.68,18.97
I2C1_SDA
  Top 0.305: U9.13 20.79,21.59 21.59,22.4 | 21.59,22.4 22.35,23.16 24.64,23.16 25.15,23.67 25.15,24.94 24.77,25.32 U2.7 | 21.59,22.4 18.03,22.4 17.78,22.65 17.78,25.19 17.53,25.45 16.26,25.45 15.88,25.07 U1.5 15.88,21.51 13.59,19.22 13.59,18.88 R24.1 13.86,18.53 U7.20
N$1
  Bottom 0.152: D1.2 41.58,39.34 38.1,35.86 38.1,33.69 D2.4
N$2
  Bottom 0.152: D2.2 41.58,30.45 38.1,26.97 38.1,24.72 | 38.1,24.43 38.1,24.72 | 38.1,24.72 D3.4
N$3
  Bottom 0.152: D3.2 41.58,21.56 38.1,18.08 38.1,15.91 D4.4
N$4
  Bottom 0.152: D4.2 40.31,12.67 38.1,10.46 38.1,7.02 D5.4
N$5
  Top 0.406: FB1.1 8.6,5.25 C15.1 8.6,2.75 9.02,2.33 13.52,2.33 14.57,3.38 | 14.57,3.38 C25.1 | U7.5 13.86,3.71 14.1,3.47 14.48,3.47 14.57,3.38
N$6
  Bottom 0.152: D5.2 43.22,4.07 43.18,4.11 41.91,4.11 39.88,2.08 37.47,2.08 36.83,2.71 36.83,37 36.2,37 35.56,37.64 35.56,40.43 35.05,40.94 30.77,40.94 D6.4
N$7
  Bottom 0.152: D6.2 32.69,39.34 29.21,35.86 29.21,33.69 D7.4
N$8
  Bottom 0.152: D7.2 32.69,30.45 29.21,26.97 29.21,24.8 D8.4
N$9
  Top 0.305: U4.6 6.11,28.14 C12.1
N$10
  Top 0.305: U4.9 3.23,24.92 R5.1
N$11
  Top 0.305: U4.11 2.88,23.92 R6.2
N$12
  Top 0.406: D27.C 41.15,29.8 U3.1
N$13
  Top 0.406: D26.C 39.23,27.85 39.62,28.24 39.62,30.53 39.37,30.78 U3.5
N$14
  Top 0.305: U4.26 13.13,24.42 R1.1
N$15
  Top 0.305: U4.25 11.09,23.92 R2.1
N$16
  Top 0.406: R7.1 38.58,26.12 D26.A D27.A
N$18
  Top 0.406: S1.3 43.4,37.17 43.4,33.36 43.43,33.32 C14.1 43.31,33.32 | 43.94,36.62 JP2.1 | 43.31,33.32 R8.1 40.64,33.41 40.64,33.57 41.18,33.04 U3.3 | 43.43,33.44 43.31,33.32
  Top 0.813: 43.4,37.17 43.94,36.62
N$19
  Top 0.406: U3.6 36.12,29.83 R9.2
N$20
  Top 0.406: U6.1 44.15,19.42 R10.2
N$21
  Top 0.406: U6.6 37.39,19.42 R11.2 37.34,17.7 C18.2
N$22
  Top 0.406: U5.4 28.22,15.51 28.19,15.54 27.82,15.54 C17.1
N$23
  Top 0.305: U7.31 7.28,9.22 R18.1 6.8,8.74 6.86,8.68 6.86,8.61 R17.1
N$24
  Top 0.152: R14.1 D28.A
N$27
  Top 0.305: U2.6 25.27,26.59 26.16,27.48 26.16,31.28 G1.+
N$28
  Top 0.406: U8.4 30.12,22.17 C27.1
N$29
  Top 0.152: U7.4 13.06,7.65 13.46,8.05 16.64,8.05 17.4,7.29 18.41,7.29 19.43,8.3 20.7,8.3 20.95,8.05 20.95,6.58 C26.1 21.01,4.01 S2.2
N$31
  Bottom 0.152: D8.2 32.69,21.56 29.21,18.08 29.21,15.91 D9.4
N$32
  Bottom 0.152: D9.2 32.69,12.67 29.21,9.19 29.21,7.02 D10.4
N$33
  Bottom 0.152: D10.2 32.69,3.78 30.99,2.08 28.57,2.08 27.94,2.71 27.94,35.86 28.7,36.62 28.7,37.64 27.94,38.4 27.94,39.03 26.04,40.94 21.88,40.94 D11.4
N$34
  Bottom 0.152: D11.2 23.8,39.34 20.32,35.86 20.32,33.69 D12.4
N$35
  Bottom 0.152: D12.2 23.8,30.45 20.32,26.97 20.32,24.8 D13.4
N$36
  Bottom 0.152: D13.2 23.8,21.56 20.32,18.08 20.32,15.91 D14.4
N$37
  Bottom 0.152: D14.2 23.8,12.67 20.32,9.19 20.32,7.02 D15.4
N$38
  Bottom 0.152: D15.2 23.8,3.78 22.1,2.08 19.68,2.08 19.05,2.71 19.05,39.03 17.14,40.94 12.99,40.94 D16.4
N$39
  Bottom 0.152: D16.2 14.91,39.34 11.43,35.86 11.43,33.69 D17.4
N$40
  Bottom 0.152: D17.2 14.91,30.45 11.43,26.97 11.43,24.8 D18.4
N$41
  Bottom 0.152: D18.2 14.91,21.56 11.43,18.08 11.43,15.91 D19.4
N$42
  Bottom 0.152: D19.2 14.91,12.67 13.46,11.22 13.46,8.94 13.21,8.68 12.19,8.68 11.43,7.92 11.43,7.02 D20.4
N$43
  Bottom 0.152: D20.2 14.91,3.78 13.21,2.08 10.79,2.08 10.29,2.59 10.29,8.3 11.05,9.06 11.05,9.83 10.16,10.71 10.16,40.43 9.65,40.94 4.1,40.94 D21.4
N$44
  Bottom 0.152: D21.2 6.02,39.34 2.54,35.86 2.54,33.69 D22.4
N$45
  Bottom 0.152: D22.2 6.02,30.45 2.54,26.97 2.54,24.8 D23.4
N$46
  Bottom 0.152: D23.2 6.02,21.56 2.54,18.08 2.54,15.91 D24.4
N$47
  Bottom 0.152: D24.2 6.02,12.67 2.54,9.19 2.54,7.02 D25.4
N$48
  Top 0.152: U7.13 19.72,11.62 R14.2
NAV_1
  Top 0.152: R26.3 34.73,10.93 U$1.1 38.01,10.93 39.12,9.83 39.12,4.24 37.47,2.59 C31.2 33.36,3.6 32,3.6 26.38,9.22 U7.10
NAV_2
  Top 0.152: R26.1 34.66,6.93 C33.2 | U$1.2 35.1,5.93 C33.2 | C33.2 33.36,7.67 32,7.67 29.72,9.95 19.43,9.95 18.56,10.82 U7.12
NAV_T
  Top 0.152: R26.2 35.07,10.06 35.56,9.57 35.56,8.81 35.94,8.43 U$1.T 37.97,8.43 38.48,7.92 38.48,5 37.97,4.49 34.51,4.49 C32.2 33.36,5.63 32,5.63 28.07,9.57 19.18,9.57 18.73,10.02 U7.11
PF0
  Top 0.152: 10.48,5.13 10.48,5.2 11.43,6.14 11.43,6.94 U7.2
PF1
  Top 0.152: U7.3 12.26,6.2 12.88,5.58 12.88,5.13
POWER_ON
  Top 0.406: R12.1 35.05,20.37 | 35.05,20.37 R13.2 | U6.5 35.05,20.37
RTC_SQW
  Top 0.305: U2.3 31.03,26.59 R19.1
SW_1  (via drill 0.15)
  Top 0.152: 3.94,33.95 SW1.3 4.06,33.95 v4.83,33.19 | v5.59,31.29 5.46,31.29 4.95,30.78 4.95,28.11 v3.81,26.97 | v3.94,20.62 3.94,19.31 R22.2 4.06,19.18 v4.06,17.57 | U7.25 8.63,14.02 v8.13,14.27
  Bottom 0.152: v4.83,33.19 4.83,32.05 v5.59,31.29 | v3.81,26.97 3.81,20.75 v3.94,20.62 | v8.13,14.27 8.13,14.52 7.75,14.91 6.73,14.91 v4.06,17.57
SWCLK  (via drill 0.15)
  Top 0.152: U7.24 10.66,16.18 10.41,16.43 9.65,16.43 7.75,14.52 v7.75,13.76 | v2.92,10.33 2.59,10.33 FLASH.4
  Bottom 0.152: v7.75,13.76 6.35,13.76 v2.92,10.33
SWDIO  (via drill 0.15)
  Top 0.152: U7.23 11.46,16.27 10.92,16.81 9.4,16.81 7.24,14.65 v7.24,14.4 | v3.56,11.6 2.03,11.6 1.78,11.86 FLASH.3
  Bottom 0.152: v7.24,14.4 6.35,14.4 v3.56,11.6
USART1_RX
  Top 0.152: R1.2 13.88,25.79 14.86,24.81 14.86,21.76 13.84,20.75 10.54,20.75 8.76,18.97 8.76,17.19 6.35,14.78 6.35,11.86 8.19,10.02 U7.30
  Top 0.305: R3.2 10.16,30.53 11.43,29.26 11.43,28.24 12.19,27.48 12.19,27.06 R1.2
USART1_TX  (via drill 0.15)
  Top 0.152: R2.2 12.36,25.28 12.7,24.94 14.22,24.94 14.48,24.68 14.48,21.89 13.72,21.13 10.29,21.13 8.26,19.1 8.26,17.32 5.97,15.03 5.97,11.35 v6.48,10.84 | v8,10.84 9.19,10.84 U7.29
  Top 0.305: R4.2 10.41,28.49 11.43,27.48 R2.2
  Bottom 0.152: v6.48,10.84 v8,10.84
V_BATT  (via drill 0.41 pad 0.81)
  Top 0.406: 40.39,42.46 40.4,42.48 S1.2 40.39,42.76 40.39,43.73 40.64,43.99 40.64,45 40.13,45.51 39.12,45.51 38.1,44.5 36.17,44.5 | R11.1 37.39,21.32 U6.4 40.25,21.77 R27.1 | SW1.4 1.91,32.68 0.76,33.83 0.76,39.42 2.29,40.94 3.68,40.94 4.06,41.32 7.24,41.32 7.62,40.94 32.51,40.94 36.07,44.5 | U5.3 28.26,17.51 28.7,17.06 | 28.7,17.06 29.72,17.06 30.16,17.51 U5.1 30.16,19.03 30.48,19.35 30.99,19.35 31.5,19.86 31.5,22.65 33.27,24.43 | 28.7,17.06 29.34,16.43 29.34,14.07 R20.2
  Top 0.813: R27.1 34.8,22.91 33.27,24.43 33.27,34.08 v36.58,38.15 | v36.58,40.43 36.17,44.5 36.07,44.5
  Bottom 0.813: v36.58,38.15 v36.58,40.43
VDD  (via drill 0.3 pad 0.61, 0.3 pad 0.81, 0.41 pad 0.81)
  Top 0.305: SW1.1 10.16,32.68 v9.14,31.67
  Top 0.406: R27.2 42.05,21.77 U6.3 U6.2 41.91,20.37 41.15,19.6 41.15,18.46 C18.1 | U8.1 26.99,20.18 27.94,21.13 28.55,21.13 28.96,20.72 28.96,19.64 U8.3
  Top 0.61: U8.1 26.99,18.15 v26.92,18.08
  Top 0.813: v44.7,23.03 v43.94,23.03 v43.18,23.03 42.04,23.03 42.05,23.02 R27.2 | v1.02,1.32 v20.07,1.32
  Bottom 0.305: C44.1 44.7,28.49
  Bottom 0.61: 39.37,40.94 38.1,40.94 37.59,41.45 36.83,41.45 35.81,42.46 34.4,42.46 D6.1
  Bottom 0.813: 9.14,33.83 9.14,35.86 C34.1 | 9.14,33.83 v9.14,31.67 9.14,26.97 | 9.14,26.97 9.14,24.68 | 9.14,24.68 9.14,17.95 | 9.14,17.95 9.14,15.92 | 9.14,15.92 9.14,9.19 | 9.14,9.19 9.14,6.9 | 9.14,6.9 v9.14,1.32 v1.02,1.32 0.76,1.57 0.76,44.24 1.27,44.75 3.81,44.75 6.02,42.54 D21.1 7.66,44.57 C3.1 12.7,44.75 14.91,42.54 D16.1 16.73,42.72 C4.1 21.59,44.75 23.8,42.54 D11.1 25.61,42.72 C5.1 | 18.03,33.57 18.03,35.86 C9.1 | 18.03,33.57 18.03,26.97 | 18.03,26.97 18.03,24.68 | 18.03,24.68 18.03,18.08 | 18.03,18.08 18.03,16.05 | 18.03,16.05 18.03,9.19 | 18.03,9.19 18.03,6.9 | 18.03,6.9 v18.03,1.32 v19.05,1.32 v20.07,1.32 26.92,1.32 | 26.92,33.57 26.92,35.86 C8.1 | 26.92,33.57 26.92,26.97 | 26.92,26.97 26.92,24.94 | 26.92,24.94 v26.92,18.08 | v26.92,18.08 26.92,15.79 | 26.92,15.79 26.92,9.19 | 26.92,9.19 26.92,6.9 | 26.92,6.9 26.92,1.32 | 35.81,33.57 35.81,35.86 C41.1 | 35.81,33.57 35.81,26.97 | 35.81,26.97 35.81,24.94 | 35.81,24.94 35.81,18.08 | 35.81,18.08 35.81,15.79 | 35.81,15.79 35.81,9.19 | 35.81,9.19 35.81,7.16 | 35.81,7.16 35.81,1.32 | C5.1 30.48,44.75 32.69,42.54 D6.1 34.51,42.72 | 25.4,44.75 C5.1 | D1.1 40.97,42.54 39.37,40.94 | C40.1 34.51,42.72 | 43.4,42.72 D1.1 | 44.7,26.97 44.7,28.49 44.7,33.57 44.63,33.65 D2.1 | 44.7,26.97 44.7,24.68 | 44.7,24.68 v44.7,23.03 | v44.7,23.03 44.7,18.08 | 44.7,18.08 44.7,15.79 | 44.7,15.79 44.7,9.19 | 44.7,9.19 44.7,6.9 | 44.7,6.9 44.7,1.32 35.81,1.32 | D22.1 8.97,33.65 9.14,33.83 | 26.92,1.32 35.81,1.32 | C1.1 9.14,26.97 | D23.1 9.07,24.76 9.14,24.68 | D17.1 17.7,33.65 17.78,33.57 18.03,33.57 | C39.1 18.03,26.97 | C38.1 26.92,26.97 | D12.1 26.85,33.65 26.92,33.57 | D7.1 35.74,33.65 35.81,33.57 | C42.1 35.81,26.97
  Bottom 0.813: C47.1 44.7,26.97 | D3.1 44.63,24.76 44.7,24.68 | C46.1 44.7,18.08 | D8.1 35.64,24.76 35.81,24.94 | C43.1 35.81,18.08 | D9.1 35.74,15.87 35.81,15.79 | D4.1 44.63,15.87 44.7,15.79 | D14.1 26.85,15.87 26.92,15.79 | C37.1 v26.92,18.08 | D13.1 26.75,24.76 26.92,24.94 | D18.1 17.96,24.76 18.03,24.68 | C6.1 18.03,18.08 | D19.1 17.86,15.87 18.03,16.05 | C35.1 18.03,9.19 | D20.1 17.96,6.98 18.03,6.9 | D15.1 26.85,6.98 26.92,6.9 | C36.1 26.92,9.19 | C48.1 35.81,9.19 | D10.1 35.64,6.98 35.81,7.16 | C49.1 44.7,9.19 | D5.1 44.63,6.98 44.7,6.9 | D25.1 9.07,6.98 9.14,6.9 | C7.1 9.14,9.19 | 34.8,42.72 34.51,42.72 | 43.33,42.42 D1.1 | v44.7,23.03 v43.18,23.03 | D24.1 9.09,15.87 9.14,15.92 | C2.1 9.02,18.08 9.14,17.95
VDD_3.3
  Top 0.305: R28.2 21.5,25.61 21.84,25.95 21.97,25.95 | 21.97,25.95 25.79,25.95 26.86,24.88 | 26.86,24.88 26.99,24.75 | C29.1 27.6,28.91 26.92,28.24 26.92,24.94 26.86,24.88 | C28.1 14.57,27.64 14.99,27.22 19.43,27.22 19.81,27.61 20.19,27.61 20.57,27.99 20.57,29.13 20.83,29.38 21.72,29.38 21.97,29.13 21.97,25.95
  Top 0.406: R19.2 31.03,25.32 U2.2 27.56,25.32 26.99,24.75 U8.5 25.05,22.17 C20.A | U1.8 19.68,25.07 20.07,25.45 20.87,25.45 R28.2
VIN
  Top 0.305: U4.7 U4.8 2.98,27.06 R5.2 3.05,27.31 C10.1 | C11.1 3.02,28.38 C10.1 | C10.1 3.72,28.41 4.45,29.13 4.45,31.41 5.71,32.68 5.71,33.32 4.19,34.84 4.19,39.42 3.94,39.67 3.94,40.3 4.32,40.69 6.86,40.69 8.64,38.91 8.64,37.89 8.76,37.77
  Top 0.406: U3.4 39.03,32.18 R8.2 38.95,33.4 | 38.74,33.61 38.95,33.4 | C13.2 43.69,25.45 42.42,24.18 35.56,24.18 34.8,24.94 34.8,28.75 | JP1.VBUS 8.71,37.71 8.76,37.77 10.41,39.42 38.9,39.42 | S1.1 38.9,39.42 | 38.9,39.42 38.9,33.57 | 38.9,33.57 38.9,33.1 38.86,33.07 38.86,33.32 38.95,33.4 | R7.2 35.73,27.82 34.8,28.75 | 34.8,28.75 34.8,32.81 36.07,34.08 38.39,34.08 38.9,33.57
WS2812  (via drill 0.3 pad 0.61, 0.51 pad 0.61)
  Top 0.305: v10.41,9.57 15.49,14.65 15.49,15.44 | 15.49,15.44 v15.49,16.94 | 15.49,15.44 U7.18
  Bottom 0.305: D1.4 39.45,42.54 40.64,43.73 44.32,43.73 44.96,43.1 v44.96,38.91 45.47,38.4 45.47,0.81 45.21,0.55 11.05,0.55 9.91,1.82 9.91,9.06 v10.41,9.57

### Text on the board
tNames: CR1220 | GND | XJBTech | VCC | V1.0.0 | GND | Rijn&if | Apr 16, 2016 | DIO | CLK | PJ23 | RANDOM SOURCE
bNames: rand();